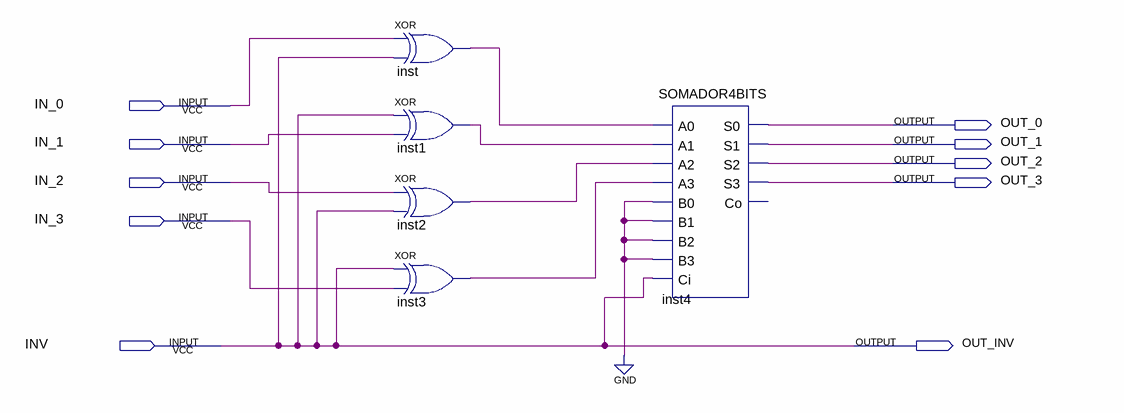
[diagram p0: schematic sheet]
// Quartus schematic CORRETORMODULO.bdf as structural Verilog: 5 symbols, 10 pins
module CORRETORMODULO (
  input  IN_0,
  input  IN_1,
  input  IN_2,
  input  IN_3,
  input  INV,
  output OUT_0,
  output OUT_1,
  output OUT_2,
  output OUT_3,
  output OUT_INV
);

  wire inst1_out, inst2_out, inst3_out, inst_out;

  xor inst (inst_out, IN_0, INV);
  xor inst1 (inst1_out, INV, IN_1);
  xor inst2 (inst2_out, IN_2, INV);
  xor inst3 (inst3_out, INV, IN_3);
  SOMADOR4BITS inst4 (
    .A0(inst_out), .A1(inst1_out), .A2(inst2_out), .A3(inst3_out), .B0(1'b0), .B1(1'b0), .B2(1'b0),
    .B3(1'b0), .Ci(INV), .S0(OUT_0), .S1(OUT_1), .S2(OUT_2), .S3(OUT_3));  // open: Co

  assign OUT_INV = INV;
endmodule
